# Altium schematic sheet ICSL_PS_Combined_BMD.SchDoc: SEUS BMD
size A; DrawnBy: Stephen Xia; DocumentNumber: 1; Revision: 0.1; SheetNumber: 1; SheetTotal: 3; ProjectName: SEUS Embedded Front-End
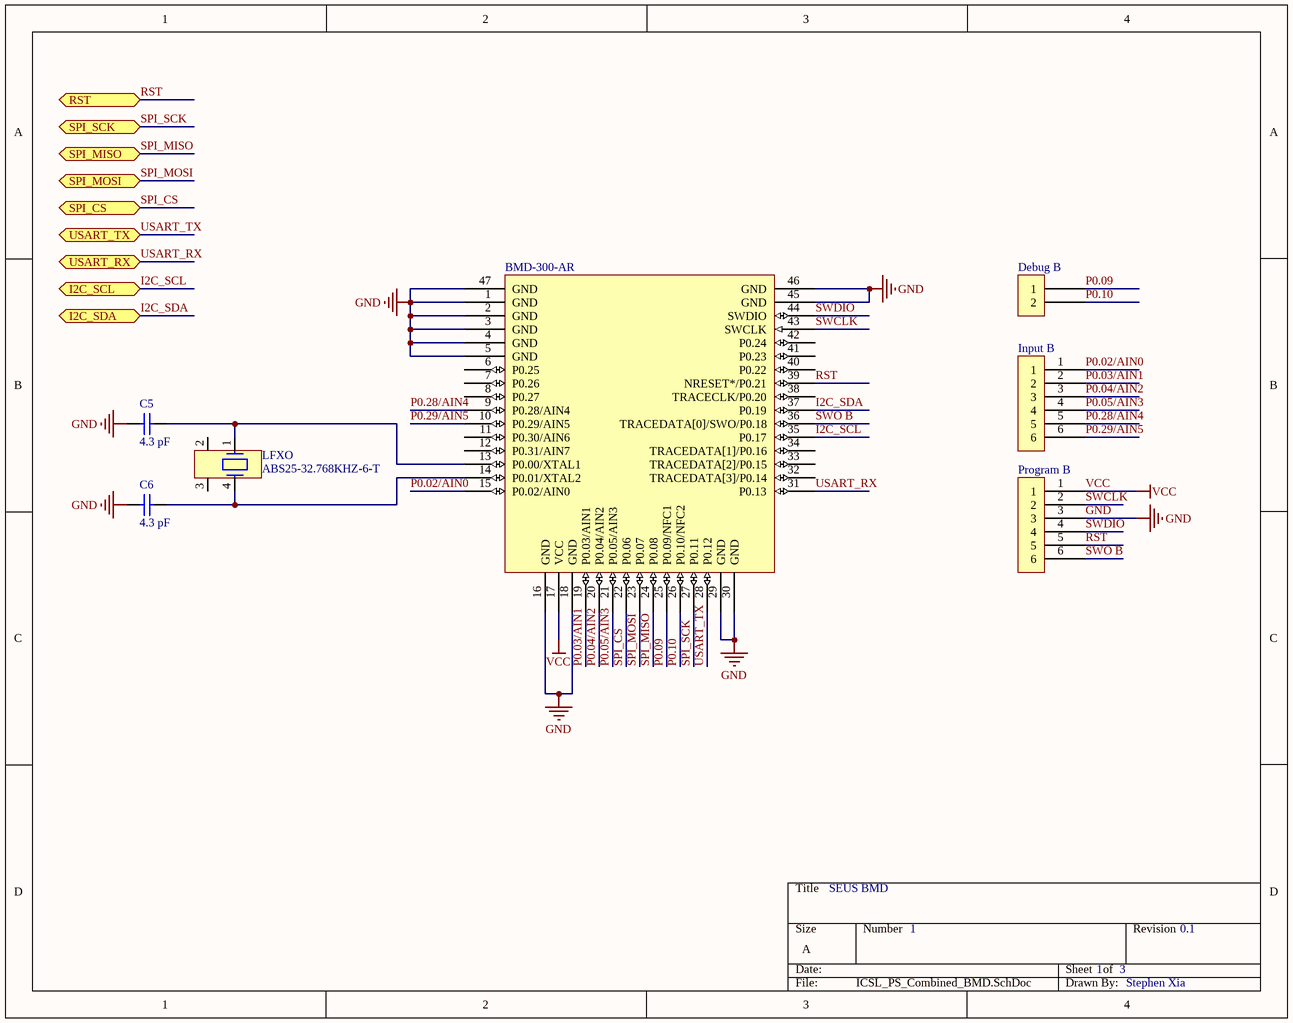
[diagram p0: ICSL_PS_Combined_BMD.SchDoc]

## Parts
BMD-300-AR  Rigado BMD-300-A-R  [BMD-300 easy]  (value not drawn)
C5  4.3 pF  [CAPC1608X87X35LL15T15]
C6  4.3 pF  [CAPC1608X87X35LL15T15]
Debug_B  TE Connectivity / AMP 3-644695-2  [PCB-i8m17woc8q0u0fbeoczf-1]  (value not drawn)
Input_B  TE Connectivity / AMP 5-146281-6  [PCB-ceua2d6kgzjhmbkiz2sm-1]  (value not drawn)
LFXO  ABS25-32.768KHZ-6-T  [XTAL_4SM_8X3R8]
Program_B  TE Connectivity / AMP 5-146281-6  [PCB-ceua2d6kgzjhmbkiz2sm-1]  (value not drawn)

## Ports
I2C_SCL (bidir), I2C_SDA (bidir), RST (bidir), SPI_CS (bidir), SPI_MISO (bidir), SPI_MOSI (bidir), SPI_SCK (bidir), USART_RX (bidir), USART_TX (bidir)

## Nets
GND: BMD-300-AR.1(GND) BMD-300-AR.2(GND) BMD-300-AR.3(GND) BMD-300-AR.4(GND) BMD-300-AR.5(GND) BMD-300-AR.16(GND) BMD-300-AR.18(GND) BMD-300-AR.29(GND) BMD-300-AR.30(GND) BMD-300-AR.45(GND) BMD-300-AR.46(GND) BMD-300-AR.47(GND) C5.1 C6.1 Program_B.3
VCC: BMD-300-AR.17(VCC) Program_B.1
I2C_SCL: BMD-300-AR.35(P0.17) ; port I2C_SCL
I2C_SDA: BMD-300-AR.37(P0.19) ; port I2C_SDA
P0.02/AIN0: BMD-300-AR.15(P0.02/AIN0) Input_B.1
P0.03/AIN1: BMD-300-AR.19(P0.03/AIN1) Input_B.2
P0.04/AIN2: BMD-300-AR.20(P0.04/AIN2) Input_B.3
P0.05/AIN3: BMD-300-AR.21(P0.05/AIN3) Input_B.4
P0.09: BMD-300-AR.25(P0.09/NFC1) Debug_B.1
P0.10: BMD-300-AR.26(P0.10/NFC2) Debug_B.2
P0.28/AIN4: BMD-300-AR.9(P0.28/AIN4) Input_B.5
P0.29/AIN5: BMD-300-AR.10(P0.29/AIN5) Input_B.6
RST: BMD-300-AR.39(NRESET*/P0.21) Program_B.5 ; port RST
SPI_CS: BMD-300-AR.22(P0.06) ; port SPI_CS
SPI_MISO: BMD-300-AR.24(P0.08) ; port SPI_MISO
SPI_MOSI: BMD-300-AR.23(P0.07) ; port SPI_MOSI
SPI_SCK: BMD-300-AR.27(P0.11) ; port SPI_SCK
SWCLK: BMD-300-AR.43(SWCLK) Program_B.2
SWDIO: BMD-300-AR.44(SWDIO) Program_B.4
SWO B: BMD-300-AR.36(TRACEDATA[0]/SWO/P0.18) Program_B.6
USART_RX: BMD-300-AR.31(P0.13) ; port USART_RX
USART_TX: BMD-300-AR.28(P0.12) ; port USART_TX
NetBMD-300-AR_13: BMD-300-AR.13(P0.00/XTAL1) C5.2 LFXO.1
NetBMD-300-AR_14: BMD-300-AR.14(P0.01/XTAL2) C6.2 LFXO.4

Not connected (* = marked no-connect by the designer): BMD-300-AR 6(P0.25) 7(P0.26) 8(P0.27) 11(P0.30/AIN6) 12(P0.31/AIN7) 32(TRACEDATA[3]/P0.14) 33(TRACEDATA[2]/P0.15) 34(TRACEDATA[1]/P0.16) 38(TRACECLK/P0.20) 40(P0.22) 41(P0.23) 42(P0.24); LFXO 2 3

## Library data of the parts
BMD-300-AR = BMD-300-A-R: Mod Ble 4.2 Nordic Nrf52832 Soc; OctopartID: f77f3a358f6828b8; Octopart URL: http://octopart.com/bmd-300-a-r-rigado-71327089; Manufacturer Part Number: BMD-300-A-R
C5 C6 = C0603C823K5RACTU: Multilayer Ceramic Capacitors MLCC - SMD/SMT 50volts 82000pF X7R 10%; Capacitance: 8.2e-08 F; Lead-Free Status: R; Voltage Rating (DC): 50.0 V; Capacitance Tolerance: ±10%; Case/Package: 0603; Dielectric Characteristic: X7R; Dielectric Material: Ceramic; Mounting Style: Surface Mount; Number of Pins: 2; Octopart Url: https://octopart.com/c0603c823k5ractu-kemet-9138604; OctopartID: 386ff1ee6ca5e7a8; Packaging: Cut Tape (CT); REACH SVHC Compliance: No SVHC; RoHS: Compliant
Debug_B = 3-644695-2: Connector Unshrouded Header 2 Position 2.54mm Solder Straight Thru-Hole; Voltage Rating (AC): 250 V; Number of Positions: 2; Mounting Angle: 180 °; Lead-Free Status: Lead Free; Shrouded: No; ELV Compliant: Compliant; Gender: Male; Flammability Rating: UL 94 V-0; Number of Rows: 1; Housing Color: Natural; Size-Width: 2.34 mm; Mounting Style: Through Hole; Orientation: Vertical; Lifecycle Status: Active; Manufacturer Part Number: 3-644695-2; OctopartID: 2792ecc2f21af855; RoHS: Compliant; Pin Pitch: 2.54 mm; Contact Plating: Tin; Housing Material: Polyester; Size-Length: 4.80 mm; Contact Material: Copper Alloy; Size-Height: 2.54 mm; Number of Contacts: 2; Packaging: Box, Bag; Octopart URL: http://octopart.com/3-644695-2-te+connectivity+%2F+amp-39514350
Input_B Program_B = 5-146281-2: Header; Breakaway; 0.100 in.; PC Board; Single; 6; 0.025 in.; 0.12 in.; 3 A; Gender: Male; Number of Contacts: 6; Lead-Free Status: Lead Free; ELV Compliant: Compliant; Lifecycle Status: Active; OctopartID: 4f28847cfb2a90ef; Manufacturer Part Number: 5-146281-2; Housing Color: Black; Flammability Rating: UL 94 V-0; Orientation: Vertical; Octopart URL: https://octopart.com/5-146281-6-te+connectivity+%2F+amp-40753677; Contact Plating: Tin, Tin over Nickel, Gold; Contact Material: Copper Alloy; RoHS: Compliant; Mounting Style: PCB
LFXO = CMP-779567-4: ABS25 Series 32.768 kHz ±20 ppm 6 pF -40 to +85 °C SMT Low Frequency Crystal; Frequency: 32.8 kHz; Equivalent Series Resistance (ESR): 50.0 kΩ; Lead-Free Status: Lead Free; Load Capacitance: 6.00 pF; REACH SVHC Compliance: No SVHC; Mounting Style: Surface Mount; Seller Landing  Url: https://octopart-clicks.com/click/track?country=US&ak=8157f166&sig=0e47fd3&sid=1106&ppid=9289409&vpid=78496461&ct=offers; OctopartID: a1e368643a447e24; Octopart Url: http://octopart.com/abs25-32.768khz-6-t-abracon-9289409; Manufacturer Part Number: ABS25-32.768KHZ-6-T; RoHS: Compliant; Number of Pins: 4; Packaging: Cut Tape (CT)